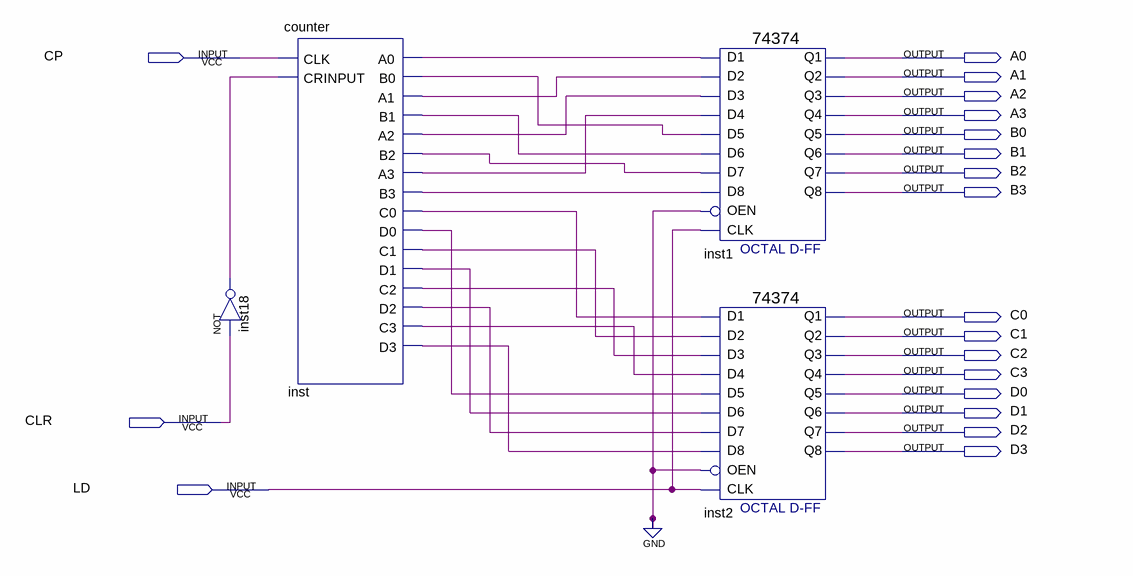
[diagram p0: schematic sheet]
// Quartus schematic latch.bdf as structural Verilog: 4 symbols, 19 pins
module latch (
  input  CP,
  input  CLR,
  input  LD,
  output A0,
  output A1,
  output A2,
  output A3,
  output B0,
  output B1,
  output B2,
  output B3,
  output C0,
  output C1,
  output C2,
  output C3,
  output D0,
  output D1,
  output D2,
  output D3
);

  wire inst18_out, inst_a0, inst_a1, inst_a2, inst_a3, inst_b0, inst_b1, inst_b2, inst_b3, inst_c0, inst_c1,
       inst_c2, inst_c3, inst_d0, inst_d1, inst_d2, inst_d3;

  not inst18 (inst18_out, CLR);
  counter inst (
    .CLK(CP), .CRINPUT(inst18_out), .A0(inst_a0), .B0(inst_b0), .A1(inst_a1), .B1(inst_b1), .A2(inst_a2),
    .B2(inst_b2), .A3(inst_a3), .B3(inst_b3), .C0(inst_c0), .D0(inst_d0), .C1(inst_c1), .D1(inst_d1),
    .C2(inst_c2), .D2(inst_d2), .C3(inst_c3), .D3(inst_d3));
  \74374  inst1 (
    .D1(inst_a0), .D2(inst_a1), .D3(inst_a2), .D4(inst_a3), .D6(inst_b1), .D5(inst_b0), .OEN(1'b0),
    .D8(inst_b3), .D7(inst_b2), .CLK(LD), .Q2(A1), .Q3(A2), .Q5(B0), .Q4(A3), .Q6(B1), .Q7(B2), .Q8(B3),
    .Q1(A0));
  \74374  inst2 (
    .D1(inst_c0), .D2(inst_c1), .D3(inst_c2), .D4(inst_c3), .D6(inst_d1), .D5(inst_d0), .OEN(1'b0),
    .D8(inst_d3), .D7(inst_d2), .CLK(LD), .Q2(C1), .Q3(C2), .Q5(D0), .Q4(C3), .Q6(D1), .Q7(D2), .Q8(D3),
    .Q1(C0));
endmodule
